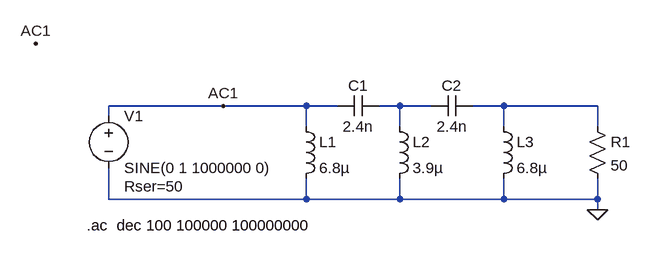
[diagram p0: schematic Draft1.asc]
Draft1.asc, the LTspice schematic file:
Version 4
SHEET 1 920 680
WIRE 288 96 112 96
WIRE 416 96 288 96
WIRE 464 96 416 96
WIRE 560 96 528 96
WIRE 608 96 560 96
WIRE 720 96 672 96
WIRE 864 96 720 96
WIRE 112 112 112 96
WIRE 416 128 416 96
WIRE 560 128 560 96
WIRE 720 128 720 96
WIRE 864 128 864 96
WIRE 112 240 112 192
WIRE 416 240 416 208
WIRE 416 240 112 240
WIRE 560 240 560 208
WIRE 560 240 416 240
WIRE 720 240 720 208
WIRE 720 240 560 240
WIRE 864 240 864 208
WIRE 864 240 720 240
WIRE 864 256 864 240
FLAG 864 256 0
FLAG 288 96 AC1
FLAG 0 0 AC1
SYMBOL voltage 112 96 R0
WINDOW 123 0 0 Left 0
WINDOW 39 24 124 Left 2
SYMATTR InstName V1
SYMATTR Value SINE(0 1 1000000 0)
SYMATTR SpiceLine Rser=50
SYMBOL ind 400 112 R0
SYMATTR InstName L1
SYMATTR Value 6.8µ
SYMBOL ind 544 112 R0
SYMATTR InstName L2
SYMATTR Value 3.9µ
SYMBOL ind 704 112 R0
SYMATTR InstName L3
SYMATTR Value 6.8µ
SYMBOL res 848 112 R0
SYMATTR InstName R1
SYMATTR Value 50
SYMBOL cap 528 80 R90
WINDOW 0 0 32 VBottom 2
WINDOW 3 32 32 VTop 2
SYMATTR InstName C1
SYMATTR Value 2.4n
SYMBOL cap 672 80 R90
WINDOW 0 0 32 VBottom 2
WINDOW 3 32 32 VTop 2
SYMATTR InstName C2
SYMATTR Value 2.4n
TEXT 78 280 Left 2 !.ac  dec 100 100000 100000000

The netlist it stands for:
* Draft1.asc
V1 AC1 0 SINE(0 1 1000000 0) Rser=50
L1 AC1 0 6.8µ
L2 N001 0 3.9µ
L3 N002 0 6.8µ
R1 N002 0 50
C1 N001 AC1 2.4n
C2 N002 N001 2.4n
.ac  dec 100 100000 100000000
.backanno
.end